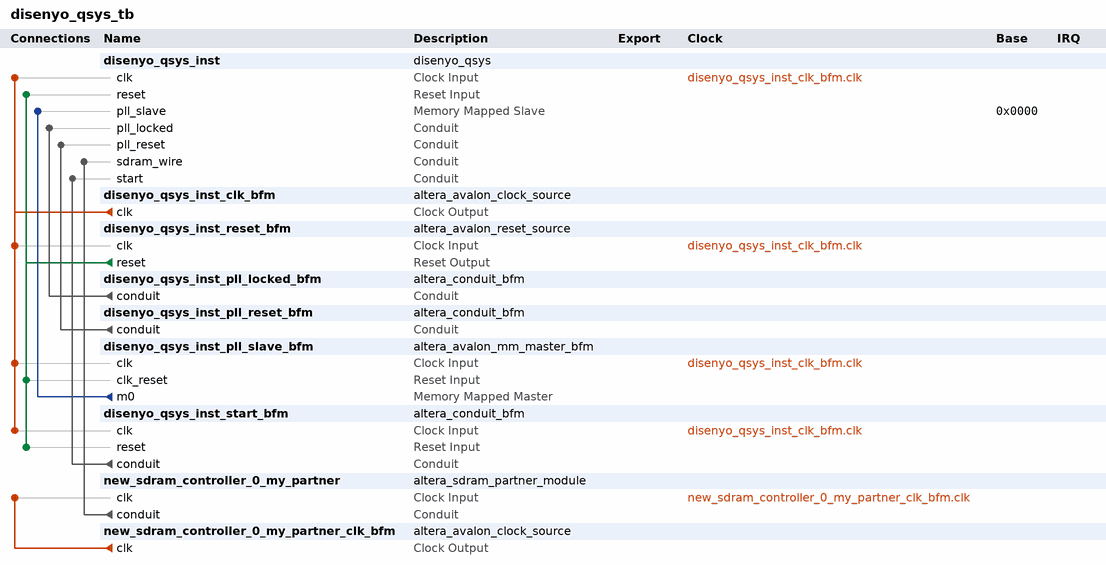
[diagram p0: system contents]
# Platform Designer (Qsys) system disenyo_qsys_tb, Cyclone IV E EP4CE115F29C7
# Parameters at their usual value, and those the tool derives, are not listed.
package require -exact qsys 19.1
create_system disenyo_qsys_tb
set_project_property DEVICE_FAMILY {Cyclone IV E}
set_project_property DEVICE EP4CE115F29C7

add_instance disenyo_qsys_inst disenyo_qsys 1.0

add_instance disenyo_qsys_inst_clk_bfm altera_avalon_clock_source 19.1

add_instance disenyo_qsys_inst_reset_bfm altera_avalon_reset_source 19.1
set_instance_parameter_value disenyo_qsys_inst_reset_bfm ASSERT_HIGH_RESET 0
set_instance_parameter_value disenyo_qsys_inst_reset_bfm INITIAL_RESET_CYCLES 50

add_instance disenyo_qsys_inst_pll_locked_bfm altera_conduit_bfm 19.1
set_instance_parameter_value disenyo_qsys_inst_pll_locked_bfm CLOCKED_SIGNAL false
set_instance_parameter_value disenyo_qsys_inst_pll_locked_bfm ENABLE_RESET false
set_instance_parameter_value disenyo_qsys_inst_pll_locked_bfm SIGNAL_DIRECTIONS input
set_instance_parameter_value disenyo_qsys_inst_pll_locked_bfm SIGNAL_WIDTHS 1

add_instance disenyo_qsys_inst_pll_reset_bfm altera_conduit_bfm 19.1
set_instance_parameter_value disenyo_qsys_inst_pll_reset_bfm CLOCKED_SIGNAL false
set_instance_parameter_value disenyo_qsys_inst_pll_reset_bfm ENABLE_RESET false
set_instance_parameter_value disenyo_qsys_inst_pll_reset_bfm SIGNAL_DIRECTIONS output
set_instance_parameter_value disenyo_qsys_inst_pll_reset_bfm SIGNAL_WIDTHS 1

add_instance disenyo_qsys_inst_pll_slave_bfm altera_avalon_mm_master_bfm 19.1
set_instance_parameter_value disenyo_qsys_inst_pll_slave_bfm ADDRESS_UNITS WORDS
set_instance_parameter_value disenyo_qsys_inst_pll_slave_bfm AV_ADDRESS_W 2
set_instance_parameter_value disenyo_qsys_inst_pll_slave_bfm AV_ALWAYS_BURST_MAX_BURST 0
set_instance_parameter_value disenyo_qsys_inst_pll_slave_bfm AV_BURSTCOUNT_W 1
set_instance_parameter_value disenyo_qsys_inst_pll_slave_bfm AV_BURST_BNDR_ONLY 0
set_instance_parameter_value disenyo_qsys_inst_pll_slave_bfm AV_BURST_LINEWRAP 0
set_instance_parameter_value disenyo_qsys_inst_pll_slave_bfm AV_CONSTANT_BURST_BEHAVIOR 1
set_instance_parameter_value disenyo_qsys_inst_pll_slave_bfm AV_FIX_READ_LATENCY 0
set_instance_parameter_value disenyo_qsys_inst_pll_slave_bfm AV_MAX_PENDING_WRITES 0
set_instance_parameter_value disenyo_qsys_inst_pll_slave_bfm AV_NUMSYMBOLS 4
set_instance_parameter_value disenyo_qsys_inst_pll_slave_bfm AV_READRESPONSE_W 1
set_instance_parameter_value disenyo_qsys_inst_pll_slave_bfm AV_READ_WAIT_TIME 0
set_instance_parameter_value disenyo_qsys_inst_pll_slave_bfm AV_WRITERESPONSE_W 1
set_instance_parameter_value disenyo_qsys_inst_pll_slave_bfm USE_BURSTCOUNT 0
set_instance_parameter_value disenyo_qsys_inst_pll_slave_bfm USE_BYTE_ENABLE 0
set_instance_parameter_value disenyo_qsys_inst_pll_slave_bfm USE_READ 1
set_instance_parameter_value disenyo_qsys_inst_pll_slave_bfm USE_READ_DATA 1
set_instance_parameter_value disenyo_qsys_inst_pll_slave_bfm USE_READ_DATA_VALID 0
set_instance_parameter_value disenyo_qsys_inst_pll_slave_bfm USE_WAIT_REQUEST 0
set_instance_parameter_value disenyo_qsys_inst_pll_slave_bfm VHDL_ID 0

add_instance disenyo_qsys_inst_start_bfm altera_conduit_bfm 19.1
set_instance_parameter_value disenyo_qsys_inst_start_bfm CLOCKED_SIGNAL true
set_instance_parameter_value disenyo_qsys_inst_start_bfm ENABLE_RESET true
set_instance_parameter_value disenyo_qsys_inst_start_bfm SIGNAL_DIRECTIONS output
set_instance_parameter_value disenyo_qsys_inst_start_bfm SIGNAL_ROLES bit
set_instance_parameter_value disenyo_qsys_inst_start_bfm SIGNAL_WIDTHS 1

add_instance new_sdram_controller_0_my_partner altera_sdram_partner_module 11.0
set_instance_parameter_value new_sdram_controller_0_my_partner CONTR_NAME disenyo_qsys_new_sdram_controller_0
set_instance_parameter_value new_sdram_controller_0_my_partner SDRAM_COL_WIDTH 10
set_instance_parameter_value new_sdram_controller_0_my_partner SDRAM_DATA_WIDTH 32
set_instance_parameter_value new_sdram_controller_0_my_partner SDRAM_ROW_WIDTH 13

add_instance new_sdram_controller_0_my_partner_clk_bfm altera_avalon_clock_source 19.1

# connections
add_connection disenyo_qsys_inst_clk_bfm.clk disenyo_qsys_inst.clk clock
add_connection disenyo_qsys_inst_clk_bfm.clk disenyo_qsys_inst_pll_slave_bfm.clk clock
add_connection disenyo_qsys_inst_clk_bfm.clk disenyo_qsys_inst_reset_bfm.clk clock
add_connection disenyo_qsys_inst_clk_bfm.clk disenyo_qsys_inst_start_bfm.clk clock
add_connection new_sdram_controller_0_my_partner_clk_bfm.clk new_sdram_controller_0_my_partner.clk clock
add_connection disenyo_qsys_inst_reset_bfm.reset disenyo_qsys_inst.reset reset
add_connection disenyo_qsys_inst_reset_bfm.reset disenyo_qsys_inst_pll_slave_bfm.clk_reset reset
add_connection disenyo_qsys_inst_reset_bfm.reset disenyo_qsys_inst_start_bfm.reset reset
add_connection disenyo_qsys_inst_pll_slave_bfm.m0 disenyo_qsys_inst.pll_slave avalon
set_connection_parameter_value disenyo_qsys_inst_pll_slave_bfm.m0/disenyo_qsys_inst.pll_slave baseAddress 0x0000
add_connection disenyo_qsys_inst_pll_locked_bfm.conduit disenyo_qsys_inst.pll_locked conduit
add_connection disenyo_qsys_inst_pll_reset_bfm.conduit disenyo_qsys_inst.pll_reset conduit
add_connection disenyo_qsys_inst_start_bfm.conduit disenyo_qsys_inst.start conduit
add_connection new_sdram_controller_0_my_partner.conduit disenyo_qsys_inst.sdram_wire conduit

set_interconnect_requirement {$system} qsys_mm.clockCrossingAdapter HANDSHAKE
set_interconnect_requirement {$system} qsys_mm.enableEccProtection FALSE
set_interconnect_requirement {$system} qsys_mm.insertDefaultSlave FALSE
set_interconnect_requirement {$system} qsys_mm.maxAdditionalLatency 1

save_system disenyo_qsys_tb.qsys
